# Altium project ATMEGA328P ETH TCP.PrjPcb
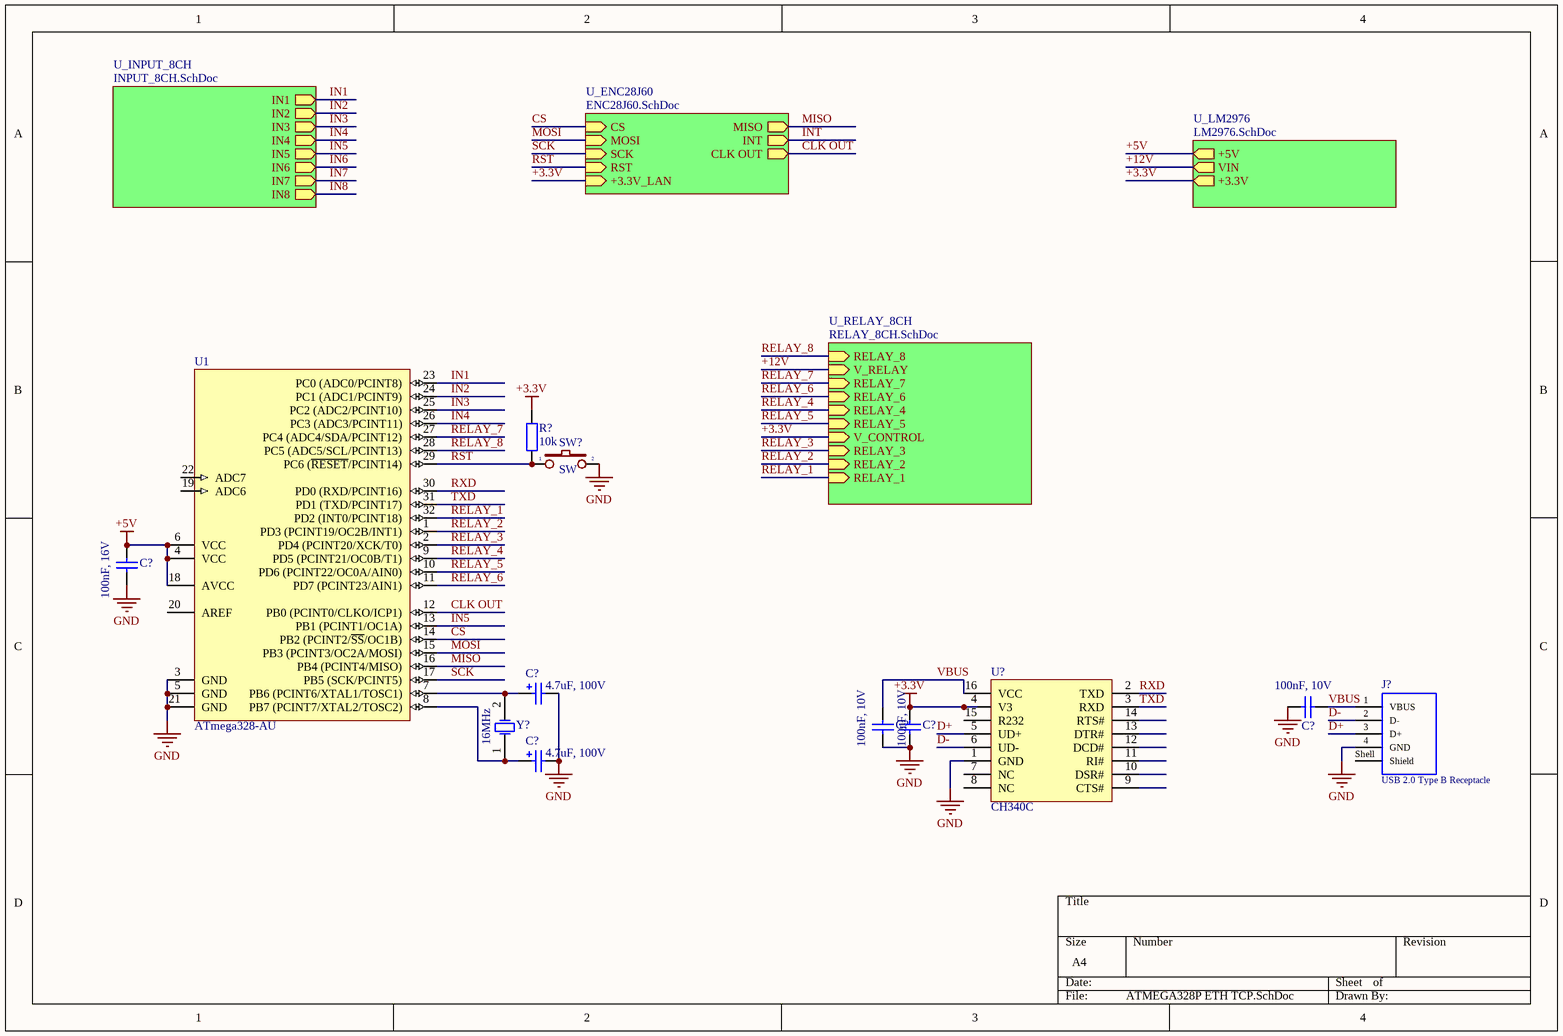
[diagram p0: ATMEGA328P ETH TCP.SchDoc]
5 sheets, 183 parts. Net scope: hierarchical (ports join the sheet entries above them; power ports are global).
Board file: ATMEGA328P ETH TCP.PcbDoc
Sheets:
  ATMEGA328P ETH TCP.SchDoc
    U_ENC28J60 = ENC28J60.SchDoc
    U_LM2976 = LM2976.SchDoc
    U_RELAY_8CH = RELAY_8CH.SchDoc
    U_INPUT_8CH = INPUT_8CH.SchDoc

## Sheet ATMEGA328P ETH TCP.SchDoc
size A4; SheetNumber: 1; SheetTotal: 5

### Parts
(Parts that share a designator on the sheet are numbered #1, #2 ... from top to bottom, then left to right.)
C?#1  100nF, 16V  [WCAP-CSGP_0402_L1W0.5H0.5]
C?#2  4.7uF, 100V  [WCAP-PSLP_D6.3H7.7]
C?#3  100nF, 10V  [WCAP-CSGP_0603_L1.6W0.8H0.8_Reflow]
C?#4  100nF, 10V  [WCAP-CSGP_0603_L1.6W0.8H0.8_Reflow]
C?#5  100nF, 10V  [WCAP-CSGP_0603_L1.6W0.8H0.8_Reflow]
C?#6  4.7uF, 100V  [WCAP-PSLP_D6.3H7.7]
J?#1  USB 2.0 Type B Receptacle  [61400416121]
R?#1  10k  [tro smd 0603]
SW?  SW  [SW1-SMD]
U1  ATmega328-AU  [TQFP32]
U?#1  CH340C  [SOIC16_50_284_25X90_SMT]
Y?  16MHz  [WE-XTAL_HC49/4HSMX]

### Sub-sheets
U_ENC28J60 = ENC28J60.SchDoc: CS (in), MOSI (in), MISO (out), SCK (in), INT (out), CLK OUT (out), RST (in), +3.3V_LAN (in)
U_INPUT_8CH = INPUT_8CH.SchDoc: IN1 (out), IN2 (out), IN3 (out), IN4 (out), IN5 (out), IN6 (out), IN7 (out), IN8 (out)
U_LM2976 = LM2976.SchDoc: +5V (out), VIN (out), +3.3V (out)
U_RELAY_8CH = RELAY_8CH.SchDoc: RELAY_1 (in), RELAY_2 (in), RELAY_3 (in), V_CONTROL (in), RELAY_5 (in), RELAY_4 (in), RELAY_6 (in), RELAY_7 (in), V_RELAY (in), RELAY_8 (in)

### Nets
+3.3V: C?#5.2 R?#1.2 U?#1.4(V3) ; sheet U_ENC28J60/+3.3V_LAN, sheet U_LM2976/+3.3V, sheet U_RELAY_8CH/V_CONTROL
+5V: C?#1.2 U1.4(VCC) U1.6(VCC) U1.18(AVCC) ; sheet U_LM2976/+5V
GND: C?#1.1 C?#2.2(N) C?#3.1 C?#4.1 C?#5.1 C?#6.2(N) J?#1.4(GND) SW?.2 U1.3(GND) U1.5(GND) U1.21(GND) U?#1.1(GND)
+12V: sheet U_LM2976/VIN, sheet U_RELAY_8CH/V_RELAY
CLK OUT: U1.12(PB0_(PCINT0/CLKO/ICP1)) ; sheet U_ENC28J60/CLK OUT
CS: U1.14(PB2_(PCINT2/~{SS}/OC1B)) ; sheet U_ENC28J60/CS
D+: J?#1.3(D+) U?#1.5(UD+)
D-: J?#1.2(D-) U?#1.6(UD-)
IN1: U1.23(PC0_(ADC0/PCINT8)) ; sheet U_INPUT_8CH/IN1
IN2: U1.24(PC1_(ADC1/PCINT9)) ; sheet U_INPUT_8CH/IN2
IN3: U1.25(PC2_(ADC2/PCINT10)) ; sheet U_INPUT_8CH/IN3
IN4: U1.26(PC3_(ADC3/PCINT11)) ; sheet U_INPUT_8CH/IN4
IN5: U1.13(PB1_(PCINT1/OC1A)) ; sheet U_INPUT_8CH/IN5
MISO: U1.16(PB4_(PCINT4/MISO)) ; sheet U_ENC28J60/MISO
MOSI: U1.15(PB3_(PCINT3/OC2A/MOSI)) ; sheet U_ENC28J60/MOSI
RELAY_1: U1.32(PD2_(INT0/PCINT18)) ; sheet U_RELAY_8CH/RELAY_1
RELAY_2: U1.1(PD3_(PCINT19/OC2B/INT1)) ; sheet U_RELAY_8CH/RELAY_2
RELAY_3: U1.2(PD4_(PCINT20/XCK/T0)) ; sheet U_RELAY_8CH/RELAY_3
RELAY_4: U1.9(PD5_(PCINT21/OC0B/T1)) ; sheet U_RELAY_8CH/RELAY_4
RELAY_5: U1.10(PD6_(PCINT22/OC0A/AIN0)) ; sheet U_RELAY_8CH/RELAY_5
RELAY_6: U1.11(PD7_(PCINT23/AIN1)) ; sheet U_RELAY_8CH/RELAY_6
RELAY_7: U1.27(PC4_(ADC4/SDA/PCINT12)) ; sheet U_RELAY_8CH/RELAY_7
RELAY_8: U1.28(PC5_(ADC5/SCL/PCINT13)) ; sheet U_RELAY_8CH/RELAY_8
RST: R?#1.1 SW?.1 U1.29(PC6_(~{RESET}/PCINT14)) ; sheet U_ENC28J60/RST
RXD: U1.30(PD0_(RXD/PCINT16)) U?#1.2(TXD)
SCK: U1.17(PB5_(SCK/PCINT5)) ; sheet U_ENC28J60/SCK
TXD: U1.31(PD1_(TXD/PCINT17)) U?#1.3(RXD)
VBUS: C?#3.2 C?#4.2 J?#1.1(VBUS) U?#1.16(VCC)
NetC?#2_1: C?#2.1(P) U1.7(PB6_(PCINT6/XTAL1/TOSC1)) Y?.2(OSC2)
NetC?#6_1: C?#6.1(P) U1.8(PB7_(PCINT7/XTAL2/TOSC2)) Y?.1(OSC1)

Not connected (* = marked no-connect by the designer): J?#1 Shell(Shield); U1 19(ADC6) 20(AREF) 22(ADC7); U?#1 7(NC) 8(NC) 9(CTS#) 10(DSR#) 11(RI#) 12(DCD#) 13(DTR#) 14(RTS#) 15(R232)

### Library data of the parts
C?#1 = 885012105016: WCAP-CSGP Multilayer Ceramic Chip Capacitor, General Purpose, size 0402, X5R, 100nF, 16V; Manufacturer: Wurth Elektronik; Capacitance Tolerance: +/-20%; Dissipation Factor: 5%; Isolation Resistance: 5GOhm; Technical Reference: X5R0402104M016DFCT10000; Capacitance: 100nF; Ceramic Type: X5R; ComponentLink1Description: Manufacturer Link; ComponentLink1URL: http://www.we-online.de; ComponentLink2Description: Datasheet; ComponentLink2URL: https://www.we-online.com/catalog/datasheet/885012105016.pdf; Height: 0.5mm; Length: 1mm; Manufacturer Part Number: 885012105016; Mounting Technology: SMT; Operating Temperature max.: 85C; Operating Temperature min.: -55C; Packaging: Tape and Reel; Rated Voltage: 16V; Size: 0402; Width: 0.5mm
C?#2 C?#6 = 875105945001: WCAP-PSLP Aluminum Polymer Capacitor, V-Chip, SMT, D6.3xH7.7mm, 4.7uF, 100V; Manufacturer: Wurth Elektronik; Ripple Current: 1060mA; Technical Reference: PSED0774R7M100DVCTCB000; Capacitance Tolerance: +/-20%; Dissipation Factor: 12%; Rated Voltage: 100VDC; Leakage Current: 600uA; ESR: 100mOhm; Endurance: 2000h; ComponentLink1URL: http://www.we-online.de; ComponentLink1Description: Manufacturer; Capacitance: 4.7uF; Diameter: 6.3mm; Published Date: October 2020; Packaging: Tape and Reel; Operating Temperature: -55 to +105degC; Mounting Technology: SMT; Manufacturer Part Number: 875105945001; Height: 7.7mm; ComponentLink2URL: https://www.we-online.com/catalog/datasheet/875105945001.pdf; ComponentLink2Description: Datasheet
C?#3-C?#5 = 885012206020: WCAP-CSGP Multilayer Ceramic Chip Capacitor, General Purpose, size 0603, X7R, 100nF, 10V; Manufacturer: Wurth Elektronik; Capacitance Tolerance: +/-10%; Dissipation Factor: 5%; Isolation Resistance: 5GOhm; Technical Reference: X7R0603104K010DFCT10000; Capacitance: 100nF; Ceramic Type: X7R; ComponentLink1Description: Manufacturer Link; ComponentLink1URL: http://www.we-online.de; ComponentLink2Description: Datasheet; ComponentLink2URL: https://www.we-online.com/catalog/datasheet/885012206020.pdf; Height: 0.8mm; Length: 1.6mm; Manufacturer Part Number: 885012206020; Mounting Technology: SMT; Operating Temperature max.: 125C; Operating Temperature min.: -55C; Packaging: Tape and Reel; Rated Voltage: 10V; Size: 0603; Width: 0.8mm
J?#1 = 61400416121: USB 2.0 Type B, Receptacle, Horizontal, THT; Manufacturer: Wurth Elektronik; Rated Current: 1.5A; Pin Number: 4; Interface Type: Type B; Working Voltage: 30VAC; ComponentLink1Description: Manufacturer; ComponentLink1URL: http://www.we-online.de; ComponentLink2Description: Datasheet; ComponentLink2URL: https://katalog.we-online.com/em/datasheet/61400416121.pdf; Published Date: August 2020; Manufacturer Part Number: 61400416121; Gender: Receptacle; Type: Horizontal; Packaging: Tray; Operating Temperature: -40 to +105degC; Mounting Technology: THT; Application: USB 2.0
R?#1 = Tro 0603 5% 10k: Dán; Don_Vi: Con; So_Chan: 2; Ten_Linh_Kien: Trở 0603 5% 10k; Ma_Hang: MH006316; Chung_Loai: Dán; Kieu_Chan: *
SW? = SW2: Switch button 2 pin; Value: SW chip 2 pin
U1 = ATmega328-AU: 8-bit AVR Microcontroller, 32KB Flash, 1KB EEPROM, 2KB SRAM, 32-pin TQFP, Industrial Grade (-40°C to 85°C); Published: 1-Apr-2010; DatasheetVersion: revA, Jan-2010; PackageVersion: revB, Oct-2001; PackageReference: 32A; Publisher: Altium Limited; PackageDescription: 32-Lead, 7x7x1.0 mm Body, 0.8mm Lead Pitch, Thin Profile Plastic Quad Flat Package (TQFP); Supplier 1: Digi-Key; Supplier Part Number 1: ATMEGA328-AU-ND; Supplier 2: Mouser; Supplier Part Number 2: 556-ATMEGA328-AU; Code_JEDEC: MS-026-ABA; ComponentLink1Description: Manufacturer Link; ComponentLink1URL: http://www.atmel.com/products/avr/default.asp?; ComponentLink2Description: ATmega48A/48PA/88A/88PA/168A/168PA/328/328P Datasheet; ComponentLink2URL: http://www.atmel.com/dyn/resources/prod_documents/8271.pdf; ComponentLink3Description: ATmega48A/48PA/88A/88PA/168A/168PA/328/328P Summary; ComponentLink3URL: http://www.atmel.com/dyn/resources/prod_documents/8271S.pdf; ComponentLink4Description: Atmel.com Home; ComponentLink4URL: http://www.atmel.com
U?#1 = CH340C: USB Bridge, USB to UART USB 2.0 UART Interface; Manufacturer: Olimex; Alternate Part Number-1: NA; Manufacturer Part Number: CH340C; Case/Package: SOIC16; Supplier-1: LCSC; Supplier Part Number-1: C84681
Y? = 830003237: WE-XTAL Quartz Crystal, SMT, HC49/4HSMX, 16MHz, +/-30ppm; Manufacturer: Wurth Elektronik; Frequency Stability: +/-50ppm; Load Capacitance: 16pF; ComponentLink1Description: Manufacturer; ComponentLink1URL: http://www.we-online.de; ComponentLink2Description: Datasheet; ComponentLink2URL: https://katalog.we-online.com/pbs/datasheet/830003237.pdf; Operating Temperature: -10 to +60degC; Packaging: Tape and Reel; Manufacturer Part Number: 830003237; Published Date: July 2020; Size: HC49/4HSMX; Frequency: 16MHz; Frequency Tolerance: +/-30ppm; Mounting Technology: SMT

## Sheet ENC28J60.SchDoc
size A; SheetNumber: 2; SheetTotal: 5
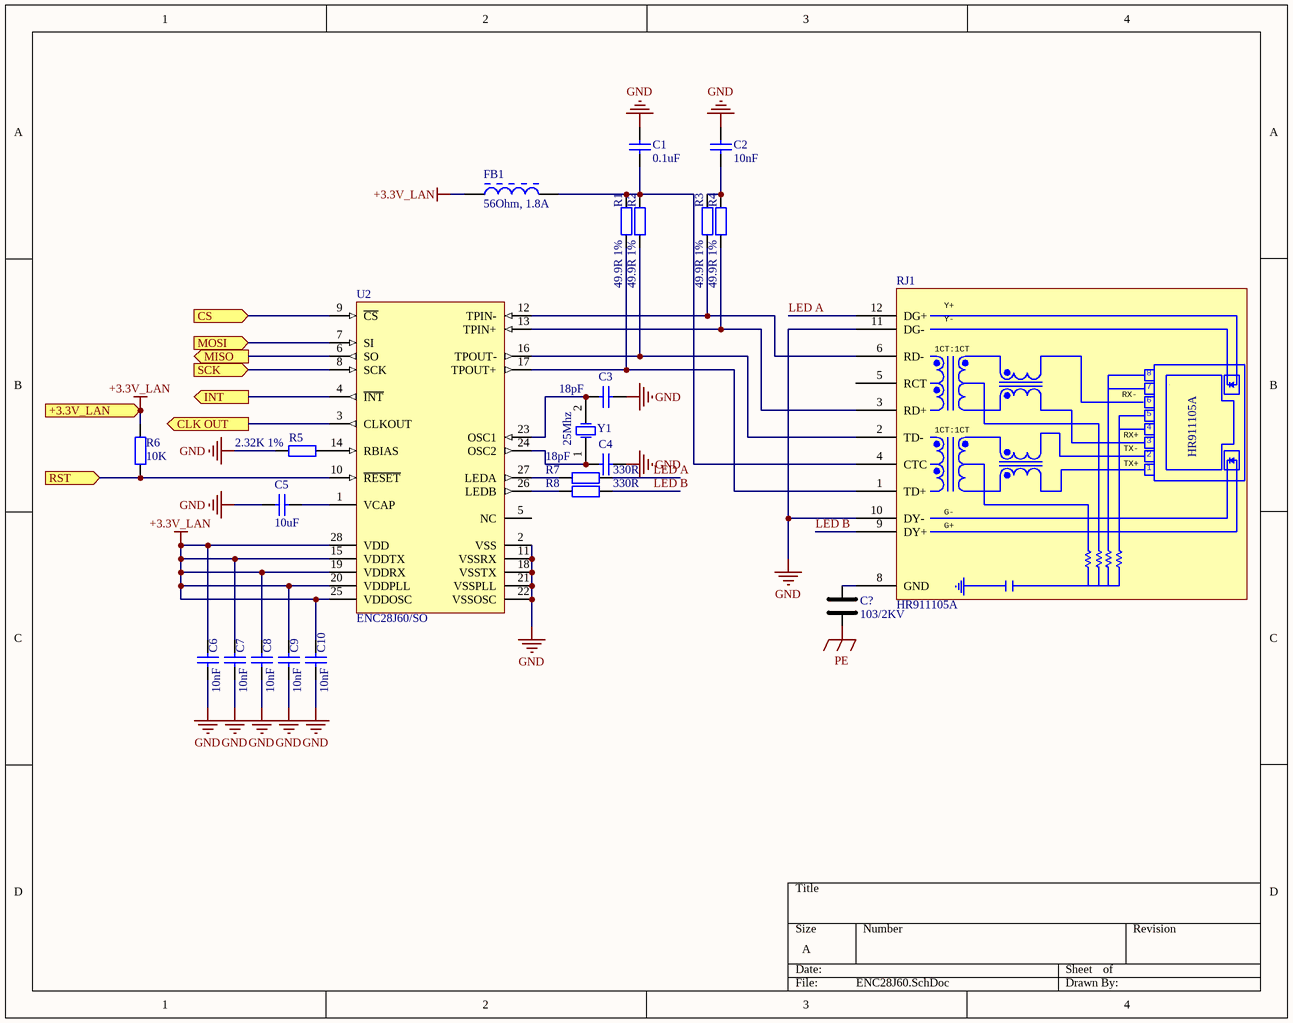
[diagram p1: ENC28J60.SchDoc]

### Parts
(Parts that share a designator on the sheet are numbered #1, #2 ... from top to bottom, then left to right.)
C1  0.1uF  [CAP_0603]
C2  10nF  [CAP_0603]
C3  18pF  [CAP_0603]
C4  18pF  [CAP_0603]
C5  10uF  [CAP_0805]
C6  10nF  [CAP_0603]
C7  10nF  [CAP_0603]
C8  10nF  [CAP_0603]
C9  10nF  [CAP_0603]
C10  10nF  [CAP_0603]
C?#7  103/2KV  [103/2KV]
FB1  56Ohm, 1.8A  [WE-CBF_0805_Wide Band]
R1  49.9R 1%  [RES_0603]
R2  49.9R 1%  [RES_0603]
R3  49.9R 1%  [RES_0603]
R4  49.9R 1%  [RES_0603]
R5  2.32K 1%  [RES_0603]
R6  10K  [RES_0603]
R7  330R  [RES_0603]
R8  330R  [RES_0603]
RJ1  HR911105A  [HR911105A]
U2  ENC28J60/SO  [SSOP-28]
Y1  25Mhz  [WE-XTAL_HC49/4H]

### Ports
+3.3V_LAN (in), CLK OUT (out), CS (in), INT (out), MISO (out), MOSI (in), RST (in), SCK (in)

### Nets
+3.3V_LAN: C6.1 C7.1 C8.1 C9.1 C10.1 FB1.1 R6.1 U2.15(VDDTX) U2.19(VDDRX) U2.20(VDDPLL) U2.25(VDDOSC) U2.28(VDD) ; port +3.3V_LAN  [project net +3.3V]
GND: C1.1 C2.1 C3.2 C4.2 C5.2 C6.2 C7.2 C8.2 C9.2 C10.2 R5.2 RJ1.10(DY-) RJ1.11(DG-) U2.2(VSS) U2.11(VSSRX) U2.18(VSSTX) U2.21(VSSPLL) U2.22(VSSOSC)
PE: C?#7.1
CLK OUT: U2.3(CLKOUT) ; port CLK OUT
CS: U2.9(~{CS}) ; port CS
INT: U2.4(~{INT}) ; port INT
LED A: R7.1 RJ1.12(DG+)
LED B: R8.1 RJ1.9(DY+)
MISO: U2.6(SO) ; port MISO
MOSI: U2.7(SI) ; port MOSI
RST: R6.2 U2.10(~{RESET}) ; port RST
SCK: U2.8(SCK) ; port SCK
NetC1_2: C1.2 FB1.2 R1.2 R2.2 RJ1.4(CTC)
NetC2_2: C2.2 R3.2 R4.2
NetC3_1: C3.1 U2.23(OSC1) Y1.2(OSC2)
NetC4_1: C4.1 U2.24(OSC2) Y1.1(OSC1)
NetC5_1: C5.1 U2.1(VCAP)
NetC?#7_2: C?#7.2 RJ1.8(GND)
NetR1_1: R1.1 RJ1.1(TD+) U2.17(TPOUT+)
NetR2_1: R2.1 RJ1.2(TD-) U2.16(TPOUT-)
NetR3_1: R3.1 RJ1.6(RD-) U2.12(TPIN-)
NetR4_1: R4.1 RJ1.3(RD+) U2.13(TPIN+)
NetR5_1: R5.1 U2.14(RBIAS)
NetR7_2: R7.2 U2.27(LEDA)
NetR8_2: R8.2 U2.26(LEDB)

Not connected (* = marked no-connect by the designer): RJ1 5(RCT); U2 5(NC)

### Notes on the sheet
- (in symbol HR911105A) Y+; Y-; 1CT:1CT; 7; RX-; RX+; TX-; TX+; G-; G+

### Library data of the parts
C1-C10 = CAP_SMD: WCAP-CSGP General Purpose Ceramic Capacitors; Part Number: 885012005001; Rated Voltage: 10VDC; Isolation Resistance: >=10GOhm; Ceramic Type: NP0; Capacitance Tolerance: +/-0.5pF; Dissipation Factor: Q>=400+20C; Capacitance: 1pF; Technical Reference: NP004021R0D010DFCT10000; ComponentLink1Description: Manufacturer; ComponentLink1URL: http://www.we-online.de; ComponentLink2Description: Datasheet; ComponentLink2URL: https://katalog.we-online.com/pbs/datasheet/885012005001.pdf; Operating Temperature: -55 to +125degC; Packaging: Tape and Reel; Publisher: Wurth Elektronik; Published Date: August 2019; Height: 0.5mm +/-0.05mm; Mounting Technology: SMT; Size: 0402
FB1 = 742792015: WE-CBF SMT EMI Suppression Ferrite Bead, size 0805, 56Ohm, 1.8A; Manufacturer: Wurth Elektronik; Impedance max.: 230Ohm; DC Resistance max.: 0.3Ohm; Type: Wide Band; ComponentLink1Description: Manufacturer; ComponentLink1URL: http://www.we-online.de; ComponentLink2Description: Datasheet; ComponentLink2URL: https://www.we-online.com/catalog/datasheet/742792015.pdf; Operating Temperature: -55 to +125degC; Packaging: Tape and Reel; Published Date: December 2021; Rated Current: 1.8A; Manufacturer Part Number: 742792015; Impedance @100MHz: 56Ohm; Mounting Technology: SMT; Size: 0805; Height: 0.9mm; Length: 2mm; Width: 1.2mm
R1-R8 = RES_SMD: WRIS-KSKE SMT Thick Film Resistor, 0.125W; Manufacturer: Wurth Elektronik; Manufacturer Part Number: 560050310010; Rated Current: 0.5A; Resistance: 0.5Ohm; Temperature Coefficient of Resistance: 200ppm/degC; Technical Reference: KE0402R500F108HAATH0000; Resistance Tolerance: +/-1%; ComponentLink1Description: Manufacturer; ComponentLink1URL: http://www.we-online.de; ComponentLink2Description: Datasheet; ComponentLink2URL: https://www.we-online.com/catalog/datasheet/560050310010.pdf; Published Date: May 2020; Rated Power: 0.125W; Height: 0.35mm; Operating Temperature: -55 to +155degC; Mounting Technology: SMT; Packaging: Tape and Reel; Size: 0402; Length: 1mm; Width: 0.5mm
RJ1 = HR911105A: Single port RJ45 with intergreated magnetics and LED
U2 = ENC28J60/SO: Stand-Alone Ethernet Controller with SPI Interface, 28-Pin SOIC; ComponentLink1Description: Manufacturer URL; ComponentLink2Description: Datasheet; ComponentLink3Description: Package Specification; ComponentLink3URL: http://www.microchip.com/stellent/groups/techpub_sg/documents/packagingspec/en012702.pdf; DatasheetVersion: revC, Jan-2008; ComponentLink1URL: http://www.microchip.com/; Code_JEDEC: MS-013; RevisionNote: URLs added.; PackageVersion: revBB, Aug-2009; PackageDescription: 28-Lead Plastic Small Outline (SO) - Wide 7.50mm Body [SOIC]; ComponentLink2URL: http://ww1.microchip.com/downloads/en/DeviceDoc/39662c.pdf; PackageReference: SOIC-SO28; PartNumber: ENC28J60/SO
Y1 = 830014948B: WE-XTAL Quartz Crystal, THT, HC49/4H, 27.12MHz, +/-30ppm; Manufacturer: Wurth Elektronik; Frequency Stability: +/-50ppm; Load Capacitance: Series Resonant; ComponentLink1Description: Manufacturer; ComponentLink1URL: http://www.we-online.de; ComponentLink2Description: Datasheet; ComponentLink2URL: https://katalog.we-online.com/pbs/datasheet/830014948B.pdf; Operating Temperature: -10 to +60degC; Packaging: Bulk; Manufacturer Part Number: 830014948B; Published Date: July 2020; Size: HC49/4H; Frequency: 27.12MHz; Frequency Tolerance: +/-30ppm; Mounting Technology: THT

## Sheet LM2976.SchDoc
size A; SheetNumber: 3; SheetTotal: 5
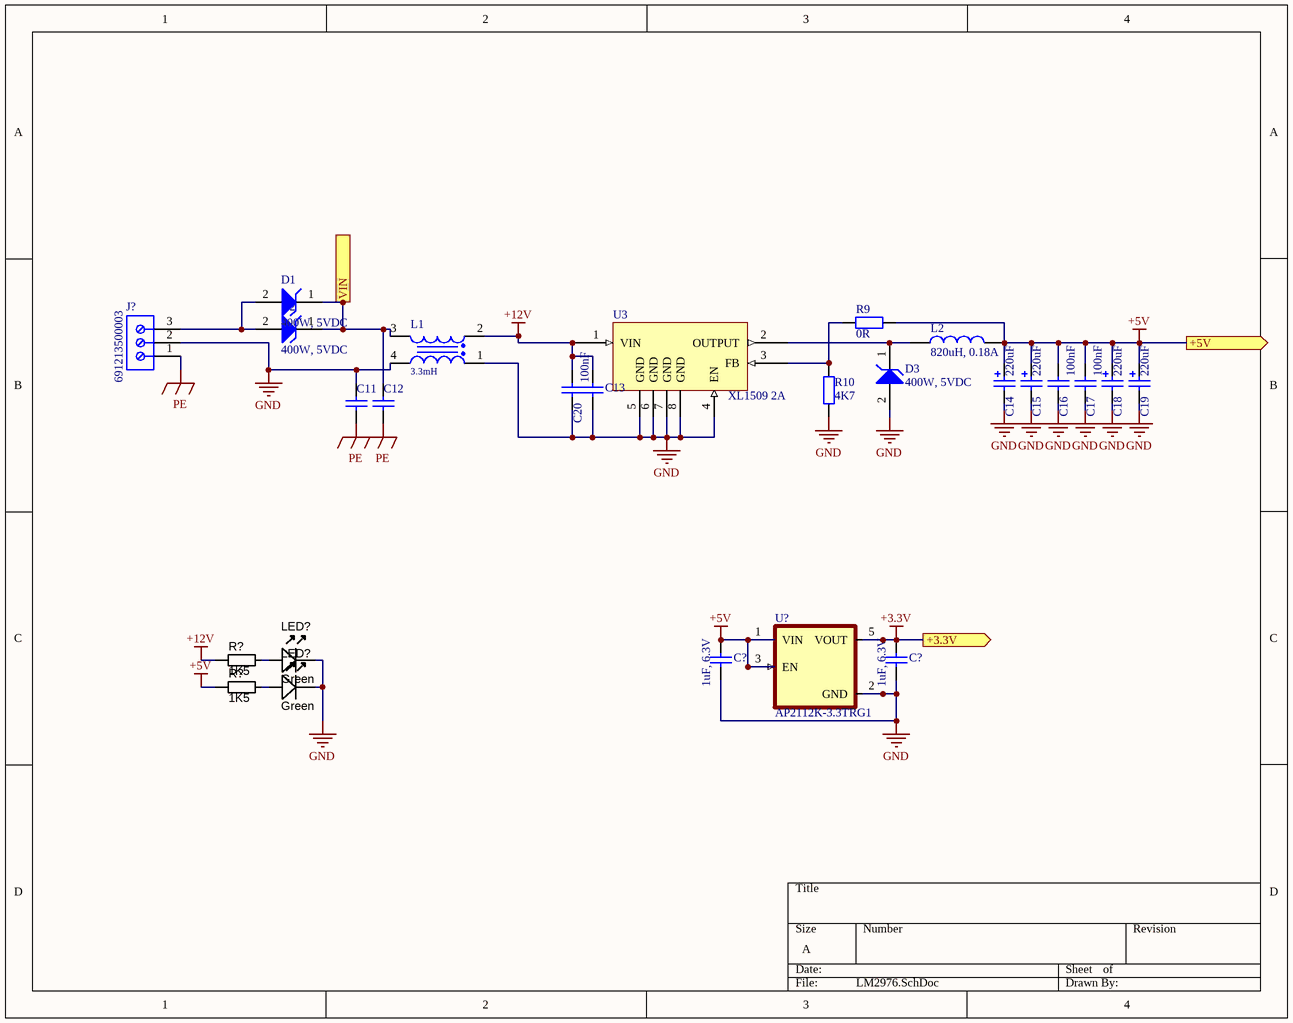
[diagram p2: LM2976.SchDoc]

### Parts
(Parts that share a designator on the sheet are numbered #1, #2 ... from top to bottom, then left to right.)
C11  Capacitor Ceramic 2KV  [103/2KV]  (value not drawn)
C12  Capacitor Ceramic 2KV  [103/2KV]  (value not drawn)
C13  R82DC3100DQ50J  [CAP FILM 5mm]  (value not drawn)
C14  220uF  [CAP_ALU_THT_8x11.5]
C15  220uF  [CAP_ALU_THT_8x11.5]
C16  100nF  [CAP_0805]
C17  100nF  [CAP_0805]
C18  220uF  [CAP_ALU_THT_8x11.5]
C19  220uF  [CAP_ALU_THT_8x11.5]
C20  100nF  [CAP_0805]
C?#8  1uF, 6.3V  [WCAP-CSGP_0603_L1.6W0.8H0.8_Reflow]
C?#9  1uF, 6.3V  [WCAP-CSGP_0603_L1.6W0.8H0.8_Reflow]
D1  400W, 5VDC  [WE-TVSP_DO-214AC_Unidirectional]
D2  400W, 5VDC  [WE-TVSP_DO-214AC_Unidirectional]
D3  400W, 5VDC  [WE-TVSP_DO-214AC_Unidirectional]
J?#2  691213500003  [691213500003]
L1  3.3mH  [WE-TFC_UU9.8V]
L2  820uH, 0.18A  [WE-PD HV_7332]
LED?#1  Green  [LED-0603-GREEN]
LED?#2  Green  [LED-0603-GREEN]
R9  0R  [RES_0603]
R10  4K7  [RES_0603]
R?#2  value 1K5  [RESC1608X55N]  (hidden comment: Thick Film)
R?#3  value 1K5  [RESC1608X55N]  (hidden comment: Thick Film)
U3  XL1509 2A  [SOIC-8]
U?#2  AP2112K-3.3TRG1  [SOT25]

### Ports
+3.3V (out), +5V (out), VIN (out)

### Nets
+3.3V: C?#9.2 U?#2.5(VOUT) ; port +3.3V
+5V: C14.2(P) C15.2(P) C16.2 C17.2 C18.2(P) C19.2(P) C?#8.2 L2.2 R9.1 R?#3.1 U?#2.1(VIN) U?#2.3(EN) ; port +5V
+12V: C13.2 C20.2 L1.2 R?#2.1 U3.1(VIN)
GND: C11.2 C13.1 C14.1(N) C15.1(N) C16.1 C17.1 C18.1(N) C19.1(N) C20.1 C?#8.1 C?#9.1 D3.2(A) J?#2.2 L1.1 L1.4 LED?#1.K LED?#2.K R10.2 U3.4(EN) U3.5(GND) U3.6(GND) U3.7(GND) U3.8(GND) U?#2.2(GND)
PE: C11.1 C12.1 J?#2.1
+12V: C12.2 D1.1(K) D2.1(K) L1.3 ; port VIN  [a separate net that carries the same name]
NetD1_2: D1.2(A) D2.2(A) J?#2.3
NetD3_1: D3.1(K) L2.1 U3.2(OUTPUT)
NetLED?#1_A: LED?#1.A R?#2.2
NetLED?#2_A: LED?#2.A R?#3.2
NetR9_2: R9.2 R10.1 U3.3(FB)

### Library data of the parts
C11 C12 = Cap2KV: Published: 8-Jun-2000; LatestRevisionDate: 17-Jul-2002; LatestRevisionNote: Re-released for DXP Platform.; PackageReference: RAD-0.3; Publisher: Altium Limited
C13 = CAP FILM: R82, Film, Metallized Polyester Stacked, Automotive Grade, 0.1 uF, 5%, 40 VAC, 63 VDC, 105C, -55C, 85C, 0.8 % , 15 GOhms, 160 V/us, 7000 pH, 0.214 g, 7.2mm, 6.5mm, 2.5mm, Lead Spacing = 5mm, 3500; Manufacturer_Name: KEMET; Manufacturer_Part_Number: R82DC3100DQ50J; Mouser Part Number: 80-R82DC3100DQ50J; Mouser Price/Stock: https://www.mouser.co.uk/ProductDetail/KEMET/R82DC3100DQ50J?qs=06HLYMEcjuXxjUSf9lh2BQ%3D%3D; Arrow Part Number: R82DC3100DQ50J; Arrow Price/Stock: https://www.arrow.com/en/products/r82dc3100dq50j/kemet-corporation?region=europe; Datasheet Link: https://content.kemet.com/datasheets/KEM_F3101_R82.pdf
C14 C15 C18 C19 = CAP_ALU_THT: WCAP-ATG8 THT Aluminum Electrolytic Capacitors; Part Number: 860010272001; Capacitance: 22uF; Dissipation Factor: 19%; Endurance: 2000h; Leakage Current: 3uA; Ripple Current max.: 66mA; Capacitance Tolerance: +/-20%; Rated Voltage: 10VDC; Technical Reference: ATBC110220M010DSPA3B000; ComponentLink1Description: Manufacturer; ComponentLink1URL: http://www.we-online.de; ComponentLink2Description: Datasheet; ComponentLink2URL: https://katalog.we-online.com/pbs/datasheet/860010272001.pdf; Length: 11mm; Mounting Technology: THT; Operating Temperature: -40 to +85degC; Packaging: Ammo Pack; Published Date: August 2019; Diameter: 5mm; Publisher: Wurth Elektronik
C16 C17 C20 = CAP_SMD: as C1 on sheet ENC28J60; ComponentLink1Description: Manufacturer; ComponentLink1URL: http://www.we-online.de; ComponentLink2Description: Datasheet; ComponentLink2URL: https://katalog.we-online.com/pbs/datasheet/885012005001.pdf; Operating Temperature: -55 to +125degC; Packaging: Tape and Reel; Publisher: Wurth Elektronik; Published Date: August 2019; Height: 0.5mm +/-0.05mm; Mounting Technology: SMT; Size: 0402
C?#8 C?#9 = 885012206002: WCAP-CSGP Multilayer Ceramic Chip Capacitor, General Purpose, size 0603, X7R, 1uF, 6.3V; Manufacturer: Wurth Elektronik; Capacitance Tolerance: +/-10%; Dissipation Factor: 10%; Isolation Resistance: 0.1GOhm; Technical Reference: X7R0603105K6R3DFCT10000; Capacitance: 1uF; Ceramic Type: X7R; ComponentLink1Description: Manufacturer Link; ComponentLink1URL: http://www.we-online.de; ComponentLink2Description: Datasheet; ComponentLink2URL: https://www.we-online.com/catalog/datasheet/885012206002.pdf; Height: 0.8mm; Length: 1.6mm; Manufacturer Part Number: 885012206002; Mounting Technology: SMT; Operating Temperature max.: 125C; Operating Temperature min.: -55C; Packaging: Tape and Reel; Rated Voltage: 6.3V; Size: 0603; Width: 0.8mm
D1-D3 = 824500500: WE-TVSP SMT Power TVS Diode, DO-214AC, 400W, 5VDC, Unidirectional; Manufacturer: Wurth Elektronik; (Reverse) Breakdown Voltage: 6.7V; (Reverse) Peak Pulse Current: 43.5A; Clamping Voltage: 9.2V; DC Operating Voltage: 5V; ComponentLink1Description: Manufacturer; Mounting Technology: SMT; Operating Temperature: -65 to +150degC; Packaging: Tape and Reel; ComponentLink2URL: https://www.we-online.com/catalog/datasheet/824500500.pdf; ComponentLink2Description: Datasheet; Manufacturer Part Number: 824500500; Polarity: Unidirectional; ComponentLink1URL: http://www.we-online.de; Published Date: July 2020; Size: DO-214AC; Power Dissipation: 400W
J?#2 = 691213500003: WR-TBL Serie 2135 Vertical Entry Modular, Rising Cage Clamp, THT, pitch 5.08mm, 3p; Manufacturer: Wurth Elektronik; Modularity: Yes; PCB/Cable/Panel: PCB; Pin Number: 3; Rated Current [UL]: 14A; Working Voltage [UL]: 300VAC; ComponentLink1Description: Manufacturer; ComponentLink1URL: http://www.we-online.de; ComponentLink2URL: https://katalog.we-online.de/em/datasheet/691213500003.pdf; ComponentLink2Description: Datasheet; Mounting Technology: THT; Manufacturer Part Number: 691213500003; Packaging: Box; Operating Temperature: -30 to +120degC; Pitch: 5.08mm; Published Date: Feburary 2021; Type: Vertical; Application: Rising Cage Clamp
L1 = 744862033: WE-TFC Common Mode Power Line Choke, Vertical, size UU9.8V, 3.3mH, 0.8A, 400VAC; Manufacturer: Wurth Elektronik; DC Resistance max.: 0.51Ohm; Insulation Test Voltage: 3000VAC; ComponentLink1Description: Manufacturer; ComponentLink1URL: http://www.we-online.de; ComponentLink2Description: Datasheet; ComponentLink2URL: https://www.we-online.com/catalog/datasheet/744862033.pdf; Manufacturer Part Number: 744862033; Published Date: September 2020; Operating Temperature: -40 to +125degC; Mounting Technology: THT; Packaging: Tray; Inductance: 3.3mH; Rated Voltage: 400VAC; Rated Current: 0.8A; Size: UU9.8V
L2 = 7687789821: WE-PD HV SMT High Voltage Power Inductor, size 7332, 820uH, 0.18A; Manufacturer: Wurth Elektronik; Operating Voltage: 400V; DC Resistance max.: 8.2Ohm; Self Resonant Frequency: 3.3MHz; Saturation Current: 0.23A; DC Resistance typ.: 6.7Ohm; ComponentLink1Description: Manufacturer; ComponentLink1URL: http://www.we-online.de; ComponentLink2Description: Datasheet; ComponentLink2URL: https://www.we-online.com/catalog/datasheet/7687789821.pdf; Packaging: Tape and Reel; Published Date: April 2020; Rated Current: 0.18A; Inductance: 820uH; Mounting Technology: SMT; Manufacturer Part Number: 7687789821; Operating Temperature: -40 to +125degC; Size: 7332
LED?#1 LED?#2 = LED_SMD_Green_0603_525nm_350mcd: LED 0603 SMD Green 525nm 350mcd 20mA; Manufacturer 1: Kingbright; Manufacturer Part Number 1: APT1608ZGCK; Material: InGaN; Ratings: 200mcd min; 350 mcd typ @ 20mA; Voltage - Forward (Vf) @ 10mA: 3.1V; Viewing Angle: 120°; Lens Style/Size: Rectangle with Flat Top, 1.2mm x 0.8mm; Voltage - Forward (Vf) @ 20mA: 3.3V; SCDType: source; Package / Case: 0603 (1608 metric); Color: Green; Current - Test: 20mA; Manufacturer 2: Kingbright Company LLC; Manufacturer Part Number 2: APT1608-WAP24; Supplier 1: Mouser; Supplier Part Number 1: 604-APT1608ZGCK; ComponentLink1URL: http://www.mouser.com/ds/2/216/APT1608ZGCK-262051.pdf; ComponentLink1Description: http://www.mouser.com/ds/2/216/APT1608ZGCK-262051.pdf; ComponentLink2Description: APT1608-WAP24 Datasheet; ComponentLink2URL: \\SVFI2\PBLShare\Eng\Electrical Engineering\Hardware\Altium\Libraries and Templates\Unreleased Components\Part Number Request 2013-10-02\APT1608-WAP24(Ver.1B).pdf
R9 R10 = RES_SMD: as R1 on sheet ENC28J60; ComponentLink1Description: Manufacturer; ComponentLink1URL: http://www.we-online.de; ComponentLink2Description: Datasheet; ComponentLink2URL: https://www.we-online.com/catalog/datasheet/560050310010.pdf; Published Date: May 2020; Rated Power: 0.125W; Height: 0.35mm; Operating Temperature: -55 to +155degC; Mounting Technology: SMT; Packaging: Tape and Reel; Size: 0402; Length: 1mm; Width: 0.5mm
R?#2 R?#3 = RES_1K5_0603_5%: Resistor SMD chip 1.5k Ohm 0.1W 5% 0603; Manufacturer 1: Yageo; Manufacturer Part Number 1: RC0603JR-071K5L; Ratings: 1/10 W; SCDType: spec; Package / Case: 0603 (1608 metric); Tolerance: ±5%; Material: thick film; Supplier 1: Digi-Key; Supplier Part Number 1: 311-1.5KGRCT-ND
U3 = XL1509: 4.5V to 40V Input,150 KHz fixed frequency / PWM buck (step-down) DC/DC converter
U?#2 = AP2112K-3.3TRG1: AP2112 Series 0.6 A 3.3 V Fixed Output SMT LDO Linear Regulator - SOT23-5; Value: *; Availability: Unavailable; Price: None; Package: None; MP: AP2112K-3.3TRG1

## Sheet RELAY_8CH.SchDoc
size A; SheetNumber: 4; SheetTotal: 5
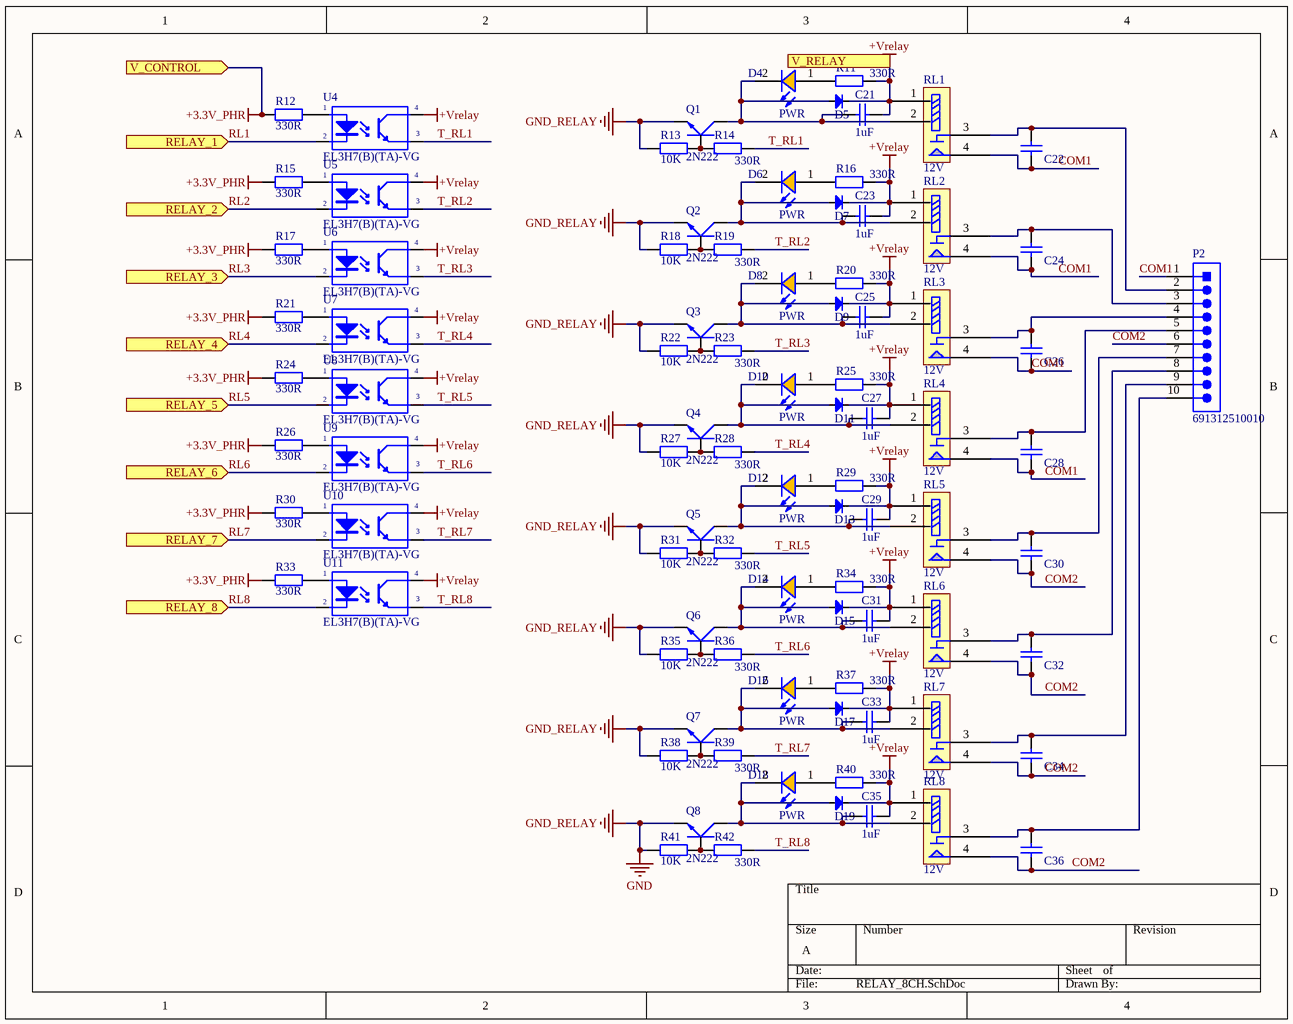
[diagram p3: RELAY_8CH.SchDoc]

### Parts
C21  1uF  [CAP_0805]
C22  R82DC3100DQ50J  [CAP FILM 5mm]  (value not drawn)
C23  1uF  [CAP_0805]
C24  R82DC3100DQ50J  [CAP FILM 5mm]  (value not drawn)
C25  1uF  [CAP_0805]
C26  R82DC3100DQ50J  [CAP FILM 5mm]  (value not drawn)
C27  1uF  [CAP_0805]
C28  R82DC3100DQ50J  [CAP FILM 5mm]  (value not drawn)
C29  1uF  [CAP_0805]
C30  R82DC3100DQ50J  [CAP FILM 5mm]  (value not drawn)
C31  1uF  [CAP_0805]
C32  R82DC3100DQ50J  [CAP FILM 5mm]  (value not drawn)
C33  1uF  [CAP_0805]
C34  R82DC3100DQ50J  [CAP FILM 5mm]  (value not drawn)
C35  1uF  [CAP_0805]
C36  R82DC3100DQ50J  [CAP FILM 5mm]  (value not drawn)
D4  PWR  [WL-SMCW_0603_L1.6W0.8H0.7]
D5  Diode SMD  [DIO-SMD-106]  (value not drawn)
D6  PWR  [WL-SMCW_0603_L1.6W0.8H0.7]
D7  Diode SMD  [DIO-SMD-106]  (value not drawn)
D8  PWR  [WL-SMCW_0603_L1.6W0.8H0.7]
D9  Diode SMD  [DIO-SMD-106]  (value not drawn)
D10  PWR  [WL-SMCW_0603_L1.6W0.8H0.7]
D11  Diode SMD  [DIO-SMD-106]  (value not drawn)
D12  PWR  [WL-SMCW_0603_L1.6W0.8H0.7]
D13  Diode SMD  [DIO-SMD-106]  (value not drawn)
D14  PWR  [WL-SMCW_0603_L1.6W0.8H0.7]
D15  Diode SMD  [DIO-SMD-106]  (value not drawn)
D16  PWR  [WL-SMCW_0603_L1.6W0.8H0.7]
D17  Diode SMD  [DIO-SMD-106]  (value not drawn)
D18  PWR  [WL-SMCW_0603_L1.6W0.8H0.7]
D19  Diode SMD  [DIO-SMD-106]  (value not drawn)
P2  691312510010  [691312510010]
Q1  2N222  [SOT23-231]
Q2  2N222  [SOT23-231]
Q3  2N222  [SOT23-231]
Q4  2N222  [SOT23-231]
Q5  2N222  [SOT23-231]
Q6  2N222  [SOT23-231]
Q7  2N222  [SOT23-231]
Q8  2N222  [SOT23-231]
R11  330R  [RES_0603]
R12  330R  [RES_0603]
R13  10K  [RES_0603]
R14  330R  [RES_0603]
R15  330R  [RES_0603]
R16  330R  [RES_0603]
R17  330R  [RES_0603]
R18  10K  [RES_0603]
R19  330R  [RES_0603]
R20  330R  [RES_0603]
R21  330R  [RES_0603]
R22  10K  [RES_0603]
R23  330R  [RES_0603]
R24  330R  [RES_0603]
R25  330R  [RES_0603]
R26  330R  [RES_0603]
R27  10K  [RES_0603]
R28  330R  [RES_0603]
R29  330R  [RES_0603]
R30  330R  [RES_0603]
R31  10K  [RES_0603]
R32  330R  [RES_0603]
R33  330R  [RES_0603]
R34  330R  [RES_0603]
R35  10K  [RES_0603]
R36  330R  [RES_0603]
R37  330R  [RES_0603]
R38  10K  [RES_0603]
R39  330R  [RES_0603]
R40  330R  [RES_0603]
R41  10K  [RES_0603]
R42  330R  [RES_0603]
RL1  12V  [HF46F]
RL2  12V  [HF46F]
RL3  12V  [HF46F]
RL4  12V  [HF46F]
RL5  12V  [HF46F]
RL6  12V  [HF46F]
RL7  12V  [HF46F]
RL8  12V  [HF46F]
U4  Part Number: EL3H7(B)(TA)-VG  [Everlight_EL3H7_B_TA_-VG_0]  (hidden comment: UNK_Everlight_EL3H7_B_TA_-VG_eec)
U5  Part Number: EL3H7(B)(TA)-VG  [Everlight_EL3H7_B_TA_-VG_0]  (hidden comment: UNK_Everlight_EL3H7_B_TA_-VG_eec)
U6  Part Number: EL3H7(B)(TA)-VG  [Everlight_EL3H7_B_TA_-VG_0]  (hidden comment: UNK_Everlight_EL3H7_B_TA_-VG_eec)
U7  Part Number: EL3H7(B)(TA)-VG  [Everlight_EL3H7_B_TA_-VG_0]  (hidden comment: UNK_Everlight_EL3H7_B_TA_-VG_eec)
U8  Part Number: EL3H7(B)(TA)-VG  [Everlight_EL3H7_B_TA_-VG_0]  (hidden comment: UNK_Everlight_EL3H7_B_TA_-VG_eec)
U9  Part Number: EL3H7(B)(TA)-VG  [Everlight_EL3H7_B_TA_-VG_0]  (hidden comment: UNK_Everlight_EL3H7_B_TA_-VG_eec)
U10  Part Number: EL3H7(B)(TA)-VG  [Everlight_EL3H7_B_TA_-VG_0]  (hidden comment: UNK_Everlight_EL3H7_B_TA_-VG_eec)
U11  Part Number: EL3H7(B)(TA)-VG  [Everlight_EL3H7_B_TA_-VG_0]  (hidden comment: UNK_Everlight_EL3H7_B_TA_-VG_eec)

### Ports
RELAY_1 (in), RELAY_2 (in), RELAY_3 (in), RELAY_4 (in), RELAY_5 (in), RELAY_6 (in), RELAY_7 (in), RELAY_8 (in), V_CONTROL (in), V_RELAY (in)

### Nets
+3.3V_PHR: R12.1 R15.1 R17.1 R21.1 R24.1 R26.1 R30.1 R33.1 ; port V_CONTROL  [project net +3.3V]
+Vrelay: C21.1 C23.1 C25.1 C27.1 C29.1 C31.1 C33.1 C35.1 D5.2(K) D7.2(K) D9.2(K) D11.2(K) D13.2(K) D15.2(K) D17.2(K) D19.2(K) R11.1 R16.1 R20.1 R25.1 R29.1 R34.1 R37.1 R40.1 RL1.1 RL2.1 RL3.1 RL4.1 RL5.1 RL6.1 RL7.1 RL8.1 U4.4(C) U5.4(C) U6.4(C) U7.4(C) U8.4(C) U9.4(C) U10.4(C) U11.4(C)
GND: Q1.1(E) Q2.1(E) Q3.1(E) Q4.1(E) Q5.1(E) Q6.1(E) Q7.1(E) Q8.1(E) R13.1 R18.1 R22.1 R27.1 R31.1 R35.1 R38.1 R41.1  [also labelled GND_RELAY]
COM1: C22.2 C24.2 C26.2 C28.2 P2.1 RL1.4 RL2.4 RL3.4 RL4.4
COM2: C30.2 C32.2 C34.2 C36.2 P2.6 RL5.4 RL6.4 RL7.4 RL8.4
RL1: U4.2(K) ; port RELAY_1  [project net RELAY_1]
RL2: U5.2(K) ; port RELAY_2  [project net RELAY_2]
RL3: U6.2(K) ; port RELAY_3  [project net RELAY_3]
RL4: U7.2(K) ; port RELAY_4  [project net RELAY_4]
RL5: U8.2(K) ; port RELAY_5  [project net RELAY_5]
RL6: U9.2(K) ; port RELAY_6  [project net RELAY_6]
RL7: U10.2(K) ; port RELAY_7  [project net RELAY_7]
RL8: U11.2(K) ; port RELAY_8  [project net RELAY_8]
T_RL1: R14.2 U4.3(E)
T_RL2: R19.2 U5.3(E)
T_RL3: R23.2 U6.3(E)
T_RL4: R28.2 U7.3(E)
T_RL5: R32.2 U8.3(E)
T_RL6: R36.2 U9.3(E)
T_RL7: R39.2 U10.3(E)
T_RL8: R42.2 U11.3(E)
NetC21_2: C21.2 D4.2(K) D5.1(A) Q1.3(C) RL1.2
NetC22_1: C22.1 P2.2 RL1.3
NetC23_2: C23.2 D6.2(K) D7.1(A) Q2.3(C) RL2.2
NetC24_1: C24.1 P2.3 RL2.3
NetC25_2: C25.2 D8.2(K) D9.1(A) Q3.3(C) RL3.2
NetC26_1: C26.1 P2.4 RL3.3
NetC27_2: C27.2 D10.2(K) D11.1(A) Q4.3(C) RL4.2
NetC28_1: C28.1 P2.5 RL4.3
NetC29_2: C29.2 D12.2(K) D13.1(A) Q5.3(C) RL5.2
NetC30_1: C30.1 P2.7 RL5.3
NetC31_2: C31.2 D14.2(K) D15.1(A) Q6.3(C) RL6.2
NetC32_1: C32.1 P2.8 RL6.3
NetC33_2: C33.2 D16.2(K) D17.1(A) Q7.3(C) RL7.2
NetC34_1: C34.1 P2.9 RL7.3
NetC35_2: C35.2 D18.2(K) D19.1(A) Q8.3(C) RL8.2
NetC36_1: C36.1 P2.10 RL8.3
NetD4_1: D4.1(A) R11.2
NetD6_1: D6.1(A) R16.2
NetD8_1: D8.1(A) R20.2
NetD10_1: D10.1(A) R25.2
NetD12_1: D12.1(A) R29.2
NetD14_1: D14.1(A) R34.2
NetD16_1: D16.1(A) R37.2
NetD18_1: D18.1(A) R40.2
NetQ1_2: Q1.2(B) R13.2 R14.1
NetQ2_2: Q2.2(B) R18.2 R19.1
NetQ3_2: Q3.2(B) R22.2 R23.1
NetQ4_2: Q4.2(B) R27.2 R28.1
NetQ5_2: Q5.2(B) R31.2 R32.1
NetQ6_2: Q6.2(B) R35.2 R36.1
NetQ7_2: Q7.2(B) R38.2 R39.1
NetQ8_2: Q8.2(B) R41.2 R42.1
NetR12_2: R12.2 U4.1(A)
NetR15_2: R15.2 U5.1(A)
NetR17_2: R17.2 U6.1(A)
NetR21_2: R21.2 U7.1(A)
NetR24_2: R24.2 U8.1(A)
NetR26_2: R26.2 U9.1(A)
NetR30_2: R30.2 U10.1(A)
NetR33_2: R33.2 U11.1(A)

### Library data of the parts
C21 C23 C25 C27 C29 C31 C33 C35 = CAP_SMD: as C1 on sheet ENC28J60; ComponentLink1Description: Manufacturer; ComponentLink1URL: http://www.we-online.de; ComponentLink2Description: Datasheet; ComponentLink2URL: https://katalog.we-online.com/pbs/datasheet/885012005001.pdf; Operating Temperature: -55 to +125degC; Packaging: Tape and Reel; Publisher: Wurth Elektronik; Published Date: August 2019; Height: 0.5mm +/-0.05mm; Mounting Technology: SMT; Size: 0402
C22 C24 C26 C28 C30 C32 C34 C36 = CAP FILM: as C13 on sheet LM2976; Manufacturer_Part_Number: R82DC3100DQ50J; Mouser Part Number: 80-R82DC3100DQ50J; Mouser Price/Stock: https://www.mouser.co.uk/ProductDetail/KEMET/R82DC3100DQ50J?qs=06HLYMEcjuXxjUSf9lh2BQ%3D%3D; Arrow Part Number: R82DC3100DQ50J; Arrow Price/Stock: https://www.arrow.com/en/products/r82dc3100dq50j/kemet-corporation?region=europe; Datasheet Link: https://content.kemet.com/datasheets/KEM_F3101_R82.pdf
D4 D6 D8 D10 D12 D14 D16 D18 = 150060AS75003: WL-SMCW SMT Mono-color Chip LED Waterclear, size 0603, Amber, 2V, 140°; Manufacturer: Wurth Elektronik; Chip Technology: AlInGaP; Dominant Wavelength: 605nm; Luminous Intensity: 350mcd; Peak Wavelength: 610nm; ComponentLink1Description: Manufacturer Link; ComponentLink1URL: http://www.we-online.de; ComponentLink2Description: Datasheet; ComponentLink2URL: https://www.we-online.com/catalog/datasheet/150060AS75003.pdf; Emitting Color: Amber; Forward Voltage: 2V; Height: 0.7mm; Length: 1.6mm; Manufacturer Part Number: 150060AS75003; Mounting Technology: SMT; Operating Temperature max.: 100C; Operating Temperature min.: -40C; Packaging: Tape and Reel; Size: 0603; Viewing Angle: 140°; Width: 0.8mm
D5 D7 D9 D11 D13 D15 D17 D19 = Diode SMD: Default Diode; Code - JEDEC: DO-214-AB; Value: 1N5007; Published: 8-Jun-2000; Revision: July-2002: Re-released for DXP Platform.; Publisher: Altium Limited
P2 = 691312510010: WR-TBL Serie 312 Open Horizontal PCB Header, Pluggable, THT, pitch 5.08mm, 10p; Manufacturer: Wurth Elektronik; Modularity: No; Pin Number: 10; Rated Current [UL]: 20A; Working Voltage [UL]: 300VAC; ComponentLink1Description: Manufacturer; ComponentLink1URL: http://www.we-online.de; ComponentLink2URL: https://katalog.we-online.de/em/datasheet/691312510010.pdf; ComponentLink2Description: Datasheet; Mounting Technology: THT; Manufacturer Part Number: 691312510010; Packaging: Box; Operating Temperature: -40 to +105degC; PCB/Cable/Panel: PCB; Pitch: 5.08mm; Published Date: Feburary 2021; Type: Horizontal; Application: Pluggable
Q1-Q8 = 2N222: NPN 600mW, ECB; Value: C1815
R11-R42 = RES_SMD: as R1 on sheet ENC28J60; ComponentLink1Description: Manufacturer; ComponentLink1URL: http://www.we-online.de; ComponentLink2Description: Datasheet; ComponentLink2URL: https://www.we-online.com/catalog/datasheet/560050310010.pdf; Published Date: May 2020; Rated Power: 0.125W; Height: 0.35mm; Operating Temperature: -55 to +155degC; Mounting Technology: SMT; Packaging: Tape and Reel; Size: 0402; Length: 1mm; Width: 0.5mm
RL1-RL8 = HONGFA HF46F: Relay 5V HF46F
U4-U11 = UNK_Everlight_EL3H7_B_TA_-VG_eec: UNK OPTOISOLATOR 3.75KV TRANS 4-SSOP; helpURL: https://upverter.com/upn/revision/a68dfb3988c96dc5/; ComponentLink2Description: Datasheet; Temperature: -55°C to +110°C; Package: SSOP4; Supplier 2: Mouser; Price: 0.304404184647; Supplier 1: Digi-Key; ComponentLink1URL: https://upverter.com/upn/revision/a68dfb3988c96dc5/; Supplier Part Number 2: 638-EL3H7BTAVG; Supplier Part Number 1: 1080-1197-1-ND; Manufacturer: Everlight; ComponentLink1Description: Upverter; ComponentLink2URL: http://www.everlight.com/datasheets/EL3H7_G.pdf; RoHS: TRUE; Mouser Part Number: 638-EL3H7BTAVG; Ipc Land Pattern Name: CAPC16080X45; Temperature Range High: +110°C; Digikey Description: UNK OPTOISOLATOR 3.75KV TRANS 4-SSOP; Digikey Part Number: 1080-1197-1-ND; Lead Free: yes; Temperature Range Low: -55°C

## Sheet INPUT_8CH.SchDoc
size A; SheetNumber: 5; SheetTotal: 5
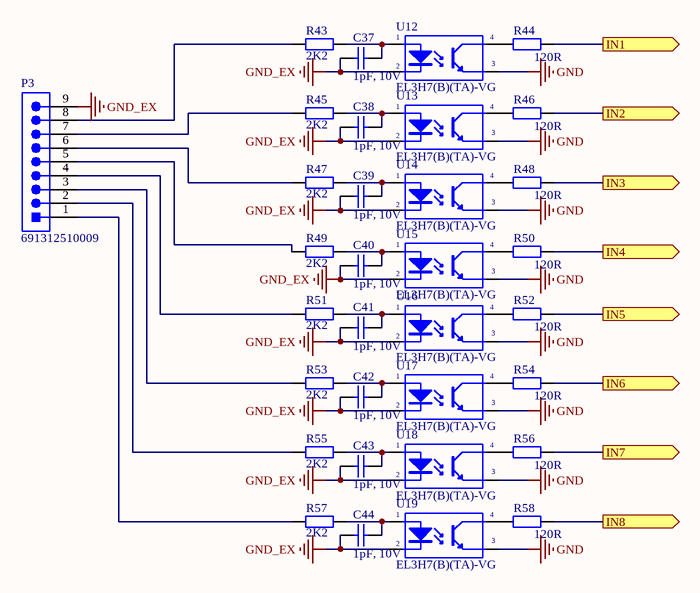
[diagram p4: INPUT_8CH.SchDoc]

### Parts
C37  1pF, 10V  [CAP_0805]
C38  1pF, 10V  [CAP_0805]
C39  1pF, 10V  [CAP_0805]
C40  1pF, 10V  [CAP_0805]
C41  1pF, 10V  [CAP_0805]
C42  1pF, 10V  [CAP_0805]
C43  1pF, 10V  [CAP_0805]
C44  1pF, 10V  [CAP_0805]
P3  691312510009  [691312510009]
R43  2K2  [RES_1206]
R44  120R  [RES_0603]
R45  2K2  [RES_1206]
R46  120R  [RES_0603]
R47  2K2  [RES_1206]
R48  120R  [RES_0603]
R49  2K2  [RES_1206]
R50  120R  [RES_0603]
R51  2K2  [RES_1206]
R52  120R  [RES_0603]
R53  2K2  [RES_1206]
R54  120R  [RES_0603]
R55  2K2  [RES_1206]
R56  120R  [RES_0603]
R57  2K2  [RES_1206]
R58  120R  [RES_0603]
U12  Part Number: EL3H7(B)(TA)-VG  [Everlight_EL3H7_B_TA_-VG_0]  (hidden comment: UNK_Everlight_EL3H7_B_TA_-VG_eec)
U13  Part Number: EL3H7(B)(TA)-VG  [Everlight_EL3H7_B_TA_-VG_0]  (hidden comment: UNK_Everlight_EL3H7_B_TA_-VG_eec)
U14  Part Number: EL3H7(B)(TA)-VG  [Everlight_EL3H7_B_TA_-VG_0]  (hidden comment: UNK_Everlight_EL3H7_B_TA_-VG_eec)
U15  Part Number: EL3H7(B)(TA)-VG  [Everlight_EL3H7_B_TA_-VG_0]  (hidden comment: UNK_Everlight_EL3H7_B_TA_-VG_eec)
U16  Part Number: EL3H7(B)(TA)-VG  [Everlight_EL3H7_B_TA_-VG_0]  (hidden comment: UNK_Everlight_EL3H7_B_TA_-VG_eec)
U17  Part Number: EL3H7(B)(TA)-VG  [Everlight_EL3H7_B_TA_-VG_0]  (hidden comment: UNK_Everlight_EL3H7_B_TA_-VG_eec)
U18  Part Number: EL3H7(B)(TA)-VG  [Everlight_EL3H7_B_TA_-VG_0]  (hidden comment: UNK_Everlight_EL3H7_B_TA_-VG_eec)
U19  Part Number: EL3H7(B)(TA)-VG  [Everlight_EL3H7_B_TA_-VG_0]  (hidden comment: UNK_Everlight_EL3H7_B_TA_-VG_eec)

### Ports
IN1 (out), IN2 (out), IN3 (out), IN4 (out), IN5 (out), IN6 (out), IN7 (out), IN8 (out)

### Nets
GND: U12.3(E) U13.3(E) U14.3(E) U15.3(E) U16.3(E) U17.3(E) U18.3(E) U19.3(E)
GND_EX: C37.1 C38.1 C39.1 C40.1 C41.1 C42.1 C43.1 C44.1 P3.9 U12.2(K) U13.2(K) U14.2(K) U15.2(K) U16.2(K) U17.2(K) U18.2(K) U19.2(K)
IN1: R44.2 ; port IN1
IN2: R46.2 ; port IN2
IN3: R48.2 ; port IN3
IN4: R50.2 ; port IN4
IN5: R52.2 ; port IN5
IN6: R54.2 ; port IN6
IN7: R56.2 ; port IN7
IN8: R58.2 ; port IN8
NetC37_2: C37.2 R43.2 U12.1(A)
NetC38_2: C38.2 R45.2 U13.1(A)
NetC39_2: C39.2 R47.2 U14.1(A)
NetC40_2: C40.2 R49.2 U15.1(A)
NetC41_2: C41.2 R51.2 U16.1(A)
NetC42_2: C42.2 R53.2 U17.1(A)
NetC43_2: C43.2 R55.2 U18.1(A)
NetC44_2: C44.2 R57.2 U19.1(A)
NetP3_1: P3.1 R57.1
NetP3_2: P3.2 R55.1
NetP3_3: P3.3 R53.1
NetP3_4: P3.4 R51.1
NetP3_5: P3.5 R49.1
NetP3_6: P3.6 R47.1
NetP3_7: P3.7 R45.1
NetP3_8: P3.8 R43.1
NetR44_1: R44.1 U12.4(C)
NetR46_1: R46.1 U13.4(C)
NetR48_1: R48.1 U14.4(C)
NetR50_1: R50.1 U15.4(C)
NetR52_1: R52.1 U16.4(C)
NetR54_1: R54.1 U17.4(C)
NetR56_1: R56.1 U18.4(C)
NetR58_1: R58.1 U19.4(C)

### Library data of the parts
C37-C44 = CAP_SMD: WCAP-CSGP General Purpose Ceramic Capacitors; Part Number: 885012005001; Rated Voltage: 10VDC; Isolation Resistance: >=10GOhm; Ceramic Type: NP0; Capacitance Tolerance: +/-0.5pF; Dissipation Factor: Q>=400+20C; Technical Reference: NP004021R0D010DFCT10000; ComponentLink1Description: Manufacturer; ComponentLink1URL: http://www.we-online.de; ComponentLink2Description: Datasheet; ComponentLink2URL: https://katalog.we-online.com/pbs/datasheet/885012005001.pdf; Operating Temperature: -55 to +125degC; Packaging: Tape and Reel; Publisher: Wurth Elektronik; Published Date: August 2019; Height: 0.5mm +/-0.05mm; Mounting Technology: SMT; Size: 0402; Capacitance: 1pF
P3 = 691312510009: WR-TBL Serie 312 Open Horizontal PCB Header, Pluggable, THT, pitch 5.08mm, 9p; Manufacturer: Wurth Elektronik; Modularity: No; Pin Number: 9; Rated Current [UL]: 20A; Working Voltage [UL]: 300VAC; ComponentLink1Description: Manufacturer; ComponentLink1URL: http://www.we-online.de; ComponentLink2URL: https://katalog.we-online.de/em/datasheet/691312510009.pdf; ComponentLink2Description: Datasheet; Mounting Technology: THT; Manufacturer Part Number: 691312510009; Packaging: Box; Operating Temperature: -40 to +105degC; PCB/Cable/Panel: PCB; Pitch: 5.08mm; Published Date: Feburary 2021; Type: Horizontal; Application: Pluggable
R43-R58 = RES_SMD: as R1 on sheet ENC28J60; ComponentLink1Description: Manufacturer; ComponentLink1URL: http://www.we-online.de; ComponentLink2Description: Datasheet; ComponentLink2URL: https://www.we-online.com/catalog/datasheet/560050310010.pdf; Published Date: May 2020; Rated Power: 0.125W; Height: 0.35mm; Operating Temperature: -55 to +155degC; Mounting Technology: SMT; Packaging: Tape and Reel; Size: 0402; Length: 1mm; Width: 0.5mm
U12-U19 = UNK_Everlight_EL3H7_B_TA_-VG_eec: UNK OPTOISOLATOR 3.75KV TRANS 4-SSOP; helpURL: https://upverter.com/upn/revision/a68dfb3988c96dc5/; ComponentLink2Description: Datasheet; Temperature: -55°C to +110°C; Package: SSOP4; Supplier 2: Mouser; Price: 0.304404184647; Supplier 1: Digi-Key; ComponentLink1URL: https://upverter.com/upn/revision/a68dfb3988c96dc5/; Supplier Part Number 2: 638-EL3H7BTAVG; Supplier Part Number 1: 1080-1197-1-ND; Manufacturer: Everlight; ComponentLink1Description: Upverter; ComponentLink2URL: http://www.everlight.com/datasheets/EL3H7_G.pdf; RoHS: TRUE; Mouser Part Number: 638-EL3H7BTAVG; Ipc Land Pattern Name: CAPC16080X45; Temperature Range High: +110°C; Digikey Description: UNK OPTOISOLATOR 3.75KV TRANS 4-SSOP; Digikey Part Number: 1080-1197-1-ND; Lead Free: yes; Temperature Range Low: -55°C

## Nets that join several sheets
+3.3V: ATMEGA328P ETH TCP (C?#5.2 R?#1.2 U?#1.4), ENC28J60 (12 pins), LM2976 (C?#9.2 U?#2.5), RELAY_8CH (8 pins)
+5V: ATMEGA328P ETH TCP (C?#1.2 U1.4 U1.6 U1.18), LM2976 (12 pins)
GND: ATMEGA328P ETH TCP (12 pins), ENC28J60 (18 pins), LM2976 (24 pins), RELAY_8CH (16 pins), INPUT_8CH (8 pins)
PE: ENC28J60 (C?#7.1), LM2976 (C11.1 C12.1 J?#2.1)
CLK OUT: ATMEGA328P ETH TCP (U1.12), ENC28J60 (U2.3)
CS: ATMEGA328P ETH TCP (U1.14), ENC28J60 (U2.9)
IN1: ATMEGA328P ETH TCP (U1.23), INPUT_8CH (R44.2)
IN2: ATMEGA328P ETH TCP (U1.24), INPUT_8CH (R46.2)
IN3: ATMEGA328P ETH TCP (U1.25), INPUT_8CH (R48.2)
IN4: ATMEGA328P ETH TCP (U1.26), INPUT_8CH (R50.2)
IN5: ATMEGA328P ETH TCP (U1.13), INPUT_8CH (R52.2)
MISO: ATMEGA328P ETH TCP (U1.16), ENC28J60 (U2.6)
MOSI: ATMEGA328P ETH TCP (U1.15), ENC28J60 (U2.7)
RELAY_1: ATMEGA328P ETH TCP (U1.32), RELAY_8CH (U4.2)
RELAY_2: ATMEGA328P ETH TCP (U1.1), RELAY_8CH (U5.2)
RELAY_3: ATMEGA328P ETH TCP (U1.2), RELAY_8CH (U6.2)
RELAY_4: ATMEGA328P ETH TCP (U1.9), RELAY_8CH (U7.2)
RELAY_5: ATMEGA328P ETH TCP (U1.10), RELAY_8CH (U8.2)
RELAY_6: ATMEGA328P ETH TCP (U1.11), RELAY_8CH (U9.2)
RELAY_7: ATMEGA328P ETH TCP (U1.27), RELAY_8CH (U10.2)
RELAY_8: ATMEGA328P ETH TCP (U1.28), RELAY_8CH (U11.2)
RST: ATMEGA328P ETH TCP (R?#1.1 SW?.1 U1.29), ENC28J60 (R6.2 U2.10)
SCK: ATMEGA328P ETH TCP (U1.17), ENC28J60 (U2.8)